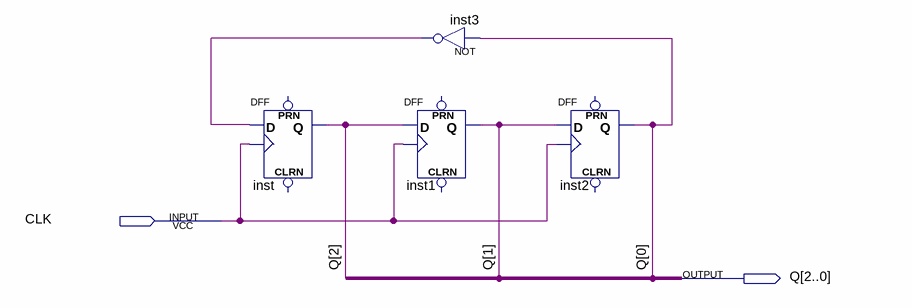
[diagram p0: schematic sheet]
// Quartus schematic exrecicio.bdf as structural Verilog: 4 symbols, 2 pins
module exrecicio (
  input  CLK,
  output [2:0] Q
);

  wire inst3_out;

  DFF inst (.CLK(CLK), .D(inst3_out), .Q(Q[2]));  // open: CLRN, PRN
  not inst3 (inst3_out, Q[0]);
  DFF inst1 (.CLK(CLK), .D(Q[2]), .Q(Q[1]));  // open: CLRN, PRN
  DFF inst2 (.CLK(CLK), .D(Q[1]), .Q(Q[0]));  // open: CLRN, PRN
endmodule
